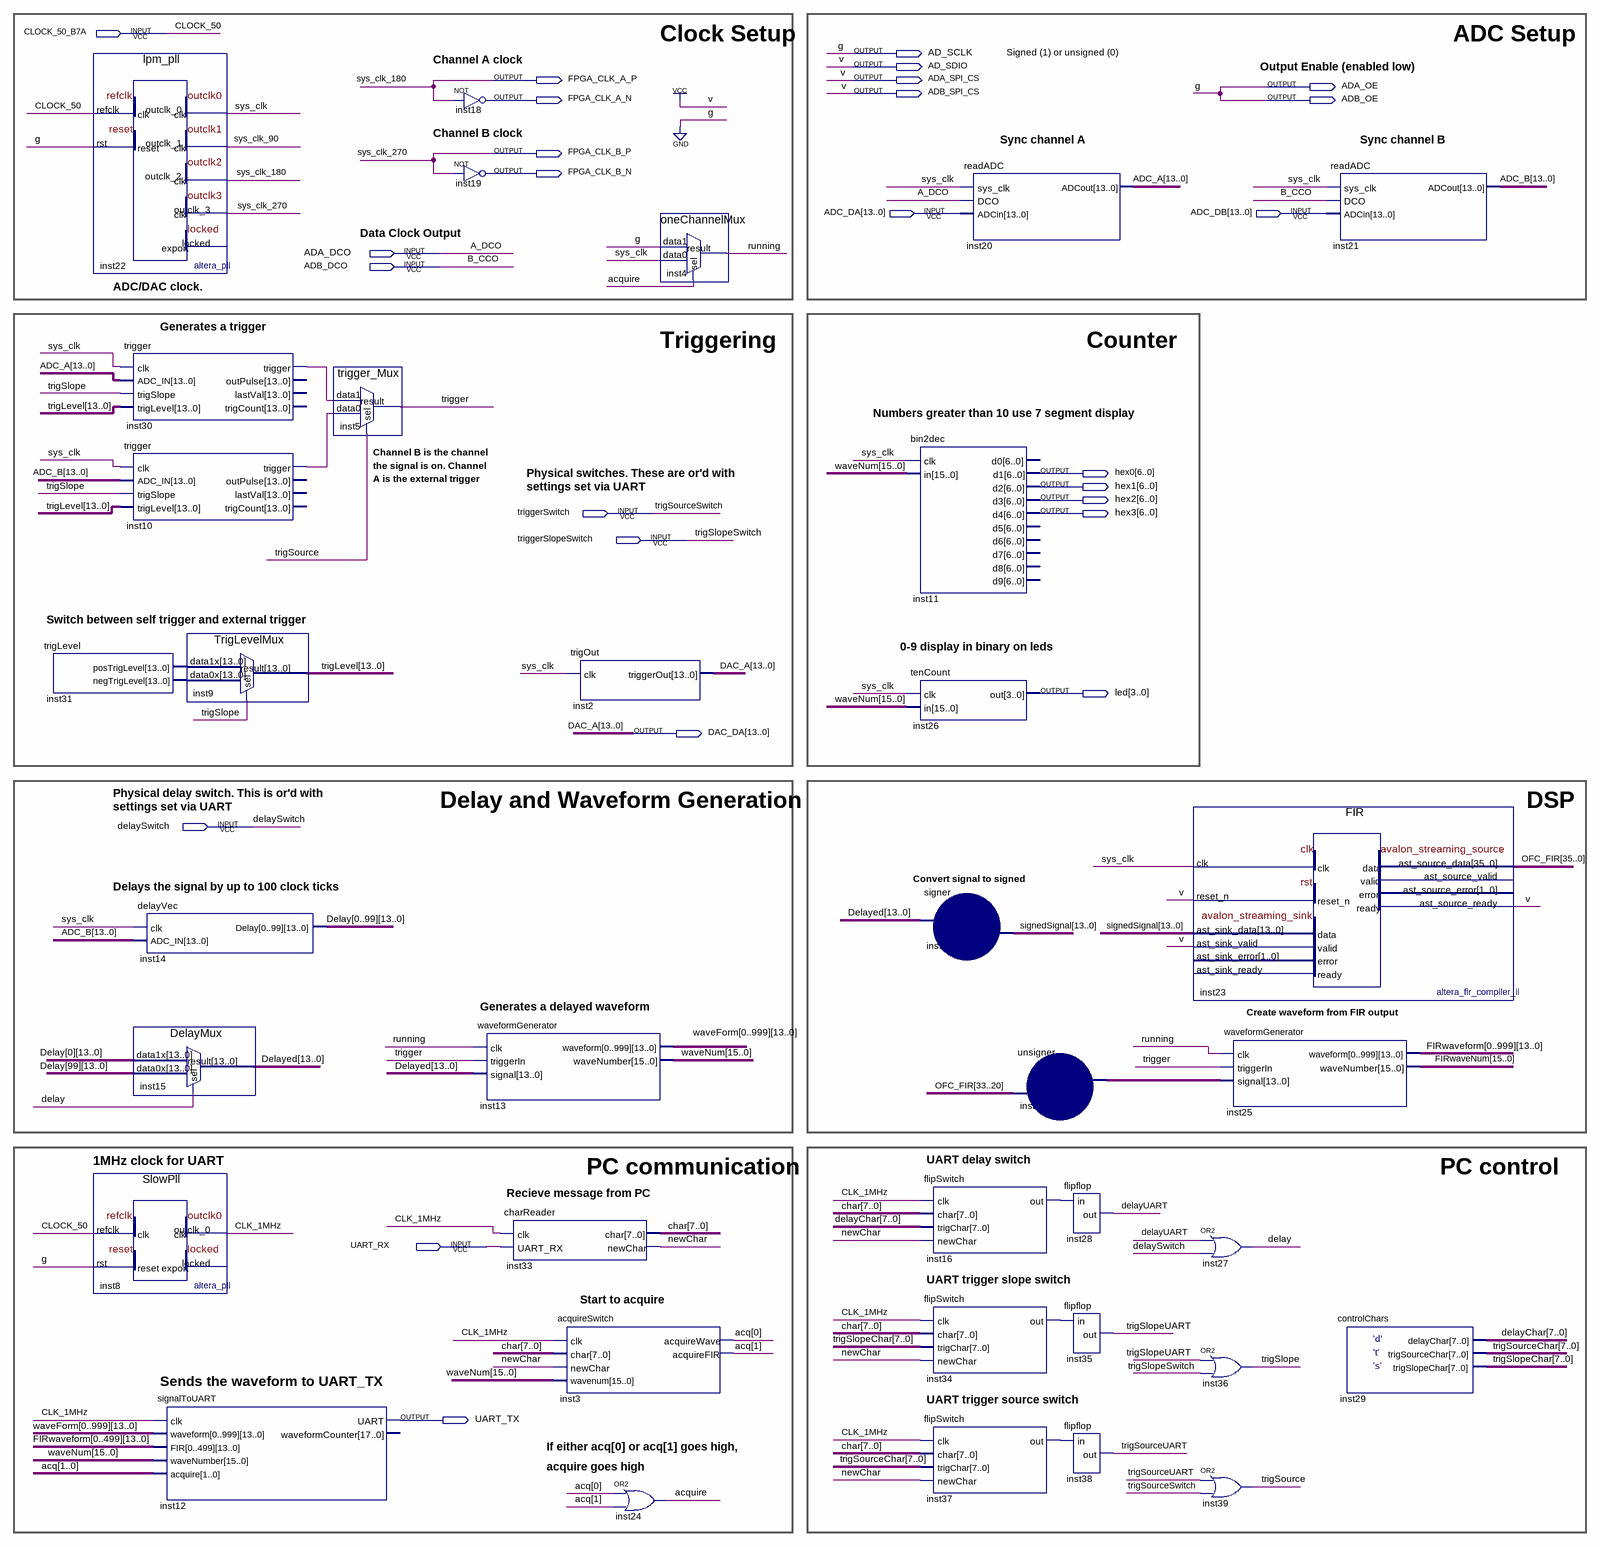
[diagram p0: schematic sheet]
// Quartus schematic ADC2UART_top.bdf as structural Verilog: 36 symbols, 26 pins
module ADC2UART_top (
  input  CLOCK_50_B7A,
  input  [13:0] ADC_DA,
  input  [13:0] ADC_DB,
  input  ADA_DCO,
  input  ADB_DCO,
  input  triggerSwitch,
  input  triggerSlopeSwitch,
  input  delaySwitch,
  input  UART_RX,
  output AD_SCLK,
  output AD_SDIO,
  output FPGA_CLK_A_P,
  output ADA_SPI_CS,
  output ADA_OE,
  output ADB_SPI_CS,
  output FPGA_CLK_A_N,
  output ADB_OE,
  output FPGA_CLK_B_P,
  output FPGA_CLK_B_N,
  output [6:0] hex0,
  output [6:0] hex1,
  output [6:0] hex2,
  output [6:0] hex3,
  output [3:0] led,
  output [13:0] DAC_DA,
  output UART_TX
);

  wire acquire, CLK_1MHz, delay, delayUART, inst10_trigger, inst16_out, inst30_trigger, inst34_out,
       inst37_out, newChar, running, sys_clk, sys_clk_90, trigger, trigSlope, trigSlopeUART, trigSource,
       trigSourceUART;
  wire [1:0] acq;
  wire [7:0] char, delayChar, trigSlopeChar, trigSourceChar;
  wire [13:0] ADC_A, ADC_B, Delay_0, Delay_1, Delay_2, Delay_3, Delay_4, Delay_5, Delay_6, Delay_7, Delay_8,
       Delay_9, Delay_10, Delay_11, Delay_12, Delay_13, Delay_14, Delay_15, Delay_16, Delay_17, Delay_18,
       Delay_19, Delay_20, Delay_21, Delay_22, Delay_23, Delay_24, Delay_25, Delay_26, Delay_27, Delay_28,
       Delay_29, Delay_30, Delay_31, Delay_32, Delay_33, Delay_34, Delay_35, Delay_36, Delay_37, Delay_38,
       Delay_39, Delay_40, Delay_41, Delay_42, Delay_43, Delay_44, Delay_45, Delay_46, Delay_47, Delay_48,
       Delay_49, Delay_50, Delay_51, Delay_52, Delay_53, Delay_54, Delay_55, Delay_56, Delay_57, Delay_58,
       Delay_59, Delay_60, Delay_61, Delay_62, Delay_63, Delay_64, Delay_65, Delay_66, Delay_67, Delay_68,
       Delay_69, Delay_70, Delay_71, Delay_72, Delay_73, Delay_74, Delay_75, Delay_76, Delay_77, Delay_78,
       Delay_79, Delay_80, Delay_81, Delay_82, Delay_83, Delay_84, Delay_85, Delay_86, Delay_87, Delay_88,
       Delay_89, Delay_90, Delay_91, Delay_92, Delay_93, Delay_94, Delay_95, Delay_96, Delay_97, Delay_98,
       Delay_99, Delayed, FIRwaveform_0, FIRwaveform_1, FIRwaveform_2, FIRwaveform_3, FIRwaveform_4,
       FIRwaveform_5, FIRwaveform_6, FIRwaveform_7, FIRwaveform_8, FIRwaveform_9, FIRwaveform_10,
       FIRwaveform_11, FIRwaveform_12, FIRwaveform_13, FIRwaveform_14, FIRwaveform_15, FIRwaveform_16,
       FIRwaveform_17, FIRwaveform_18, FIRwaveform_19, FIRwaveform_20, FIRwaveform_21, FIRwaveform_22,
       FIRwaveform_23, FIRwaveform_24, FIRwaveform_25, FIRwaveform_26, FIRwaveform_27, FIRwaveform_28,
       FIRwaveform_29, FIRwaveform_30, FIRwaveform_31, FIRwaveform_32, FIRwaveform_33, FIRwaveform_34,
       FIRwaveform_35, FIRwaveform_36, FIRwaveform_37, FIRwaveform_38, FIRwaveform_39, FIRwaveform_40,
       FIRwaveform_41, FIRwaveform_42, FIRwaveform_43, FIRwaveform_44, FIRwaveform_45, FIRwaveform_46,
       FIRwaveform_47, FIRwaveform_48, FIRwaveform_49, FIRwaveform_50, FIRwaveform_51, FIRwaveform_52,
       FIRwaveform_53, FIRwaveform_54, FIRwaveform_55, FIRwaveform_56, FIRwaveform_57, FIRwaveform_58,
       FIRwaveform_59, FIRwaveform_60, FIRwaveform_61, FIRwaveform_62, FIRwaveform_63, FIRwaveform_64,
       FIRwaveform_65, FIRwaveform_66, FIRwaveform_67, FIRwaveform_68, FIRwaveform_69, FIRwaveform_70,
       FIRwaveform_71, FIRwaveform_72, FIRwaveform_73, FIRwaveform_74, FIRwaveform_75, FIRwaveform_76,
       FIRwaveform_77, FIRwaveform_78, FIRwaveform_79, FIRwaveform_80, FIRwaveform_81, FIRwaveform_82,
       FIRwaveform_83, FIRwaveform_84, FIRwaveform_85, FIRwaveform_86, FIRwaveform_87, FIRwaveform_88,
       FIRwaveform_89, FIRwaveform_90, FIRwaveform_91, FIRwaveform_92, FIRwaveform_93, FIRwaveform_94,
       FIRwaveform_95, FIRwaveform_96, FIRwaveform_97, FIRwaveform_98, FIRwaveform_99, FIRwaveform_100,
       FIRwaveform_101, FIRwaveform_102, FIRwaveform_103, FIRwaveform_104, FIRwaveform_105, FIRwaveform_106,
       FIRwaveform_107, FIRwaveform_108, FIRwaveform_109, FIRwaveform_110, FIRwaveform_111, FIRwaveform_112,
       FIRwaveform_113, FIRwaveform_114, FIRwaveform_115, FIRwaveform_116, FIRwaveform_117, FIRwaveform_118,
       FIRwaveform_119, FIRwaveform_120, FIRwaveform_121, FIRwaveform_122, FIRwaveform_123, FIRwaveform_124,
       FIRwaveform_125, FIRwaveform_126, FIRwaveform_127, FIRwaveform_128, FIRwaveform_129, FIRwaveform_130,
       FIRwaveform_131, FIRwaveform_132, FIRwaveform_133, FIRwaveform_134, FIRwaveform_135, FIRwaveform_136,
       FIRwaveform_137, FIRwaveform_138, FIRwaveform_139, FIRwaveform_140, FIRwaveform_141, FIRwaveform_142,
       FIRwaveform_143, FIRwaveform_144, FIRwaveform_145, FIRwaveform_146, FIRwaveform_147, FIRwaveform_148,
       FIRwaveform_149, FIRwaveform_150, FIRwaveform_151, FIRwaveform_152, FIRwaveform_153, FIRwaveform_154,
       FIRwaveform_155, FIRwaveform_156, FIRwaveform_157, FIRwaveform_158, FIRwaveform_159, FIRwaveform_160,
       FIRwaveform_161, FIRwaveform_162, FIRwaveform_163, FIRwaveform_164, FIRwaveform_165, FIRwaveform_166,
       FIRwaveform_167, FIRwaveform_168, FIRwaveform_169, FIRwaveform_170, FIRwaveform_171, FIRwaveform_172,
       FIRwaveform_173, FIRwaveform_174, FIRwaveform_175, FIRwaveform_176, FIRwaveform_177, FIRwaveform_178,
       FIRwaveform_179, FIRwaveform_180, FIRwaveform_181, FIRwaveform_182, FIRwaveform_183, FIRwaveform_184,
       FIRwaveform_185, FIRwaveform_186, FIRwaveform_187, FIRwaveform_188, FIRwaveform_189, FIRwaveform_190,
       FIRwaveform_191, FIRwaveform_192, FIRwaveform_193, FIRwaveform_194, FIRwaveform_195, FIRwaveform_196,
       FIRwaveform_197, FIRwaveform_198, FIRwaveform_199, FIRwaveform_200, FIRwaveform_201, FIRwaveform_202,
       FIRwaveform_203, FIRwaveform_204, FIRwaveform_205, FIRwaveform_206, FIRwaveform_207, FIRwaveform_208,
       FIRwaveform_209, FIRwaveform_210, FIRwaveform_211, FIRwaveform_212, FIRwaveform_213, FIRwaveform_214,
       FIRwaveform_215, FIRwaveform_216, FIRwaveform_217, FIRwaveform_218, FIRwaveform_219, FIRwaveform_220,
       FIRwaveform_221, FIRwaveform_222, FIRwaveform_223, FIRwaveform_224, FIRwaveform_225, FIRwaveform_226,
       FIRwaveform_227, FIRwaveform_228, FIRwaveform_229, FIRwaveform_230, FIRwaveform_231, FIRwaveform_232,
       FIRwaveform_233, FIRwaveform_234, FIRwaveform_235, FIRwaveform_236, FIRwaveform_237, FIRwaveform_238,
       FIRwaveform_239, FIRwaveform_240, FIRwaveform_241, FIRwaveform_242, FIRwaveform_243, FIRwaveform_244,
       FIRwaveform_245, FIRwaveform_246, FIRwaveform_247, FIRwaveform_248, FIRwaveform_249, FIRwaveform_250,
       FIRwaveform_251, FIRwaveform_252, FIRwaveform_253, FIRwaveform_254, FIRwaveform_255, FIRwaveform_256,
       FIRwaveform_257, FIRwaveform_258, FIRwaveform_259, FIRwaveform_260, FIRwaveform_261, FIRwaveform_262,
       FIRwaveform_263, FIRwaveform_264, FIRwaveform_265, FIRwaveform_266, FIRwaveform_267, FIRwaveform_268,
       FIRwaveform_269, FIRwaveform_270, FIRwaveform_271, FIRwaveform_272, FIRwaveform_273, FIRwaveform_274,
       FIRwaveform_275, FIRwaveform_276, FIRwaveform_277, FIRwaveform_278, FIRwaveform_279, FIRwaveform_280,
       FIRwaveform_281, FIRwaveform_282, FIRwaveform_283, FIRwaveform_284, FIRwaveform_285, FIRwaveform_286,
       FIRwaveform_287, FIRwaveform_288, FIRwaveform_289, FIRwaveform_290, FIRwaveform_291, FIRwaveform_292,
       FIRwaveform_293, FIRwaveform_294, FIRwaveform_295, FIRwaveform_296, FIRwaveform_297, FIRwaveform_298,
       FIRwaveform_299, FIRwaveform_300, FIRwaveform_301, FIRwaveform_302, FIRwaveform_303, FIRwaveform_304,
       FIRwaveform_305, FIRwaveform_306, FIRwaveform_307, FIRwaveform_308, FIRwaveform_309, FIRwaveform_310,
       FIRwaveform_311, FIRwaveform_312, FIRwaveform_313, FIRwaveform_314, FIRwaveform_315, FIRwaveform_316,
       FIRwaveform_317, FIRwaveform_318, FIRwaveform_319, FIRwaveform_320, FIRwaveform_321, FIRwaveform_322,
       FIRwaveform_323, FIRwaveform_324, FIRwaveform_325, FIRwaveform_326, FIRwaveform_327, FIRwaveform_328,
       FIRwaveform_329, FIRwaveform_330, FIRwaveform_331, FIRwaveform_332, FIRwaveform_333, FIRwaveform_334,
       FIRwaveform_335, FIRwaveform_336, FIRwaveform_337, FIRwaveform_338, FIRwaveform_339, FIRwaveform_340,
       FIRwaveform_341, FIRwaveform_342, FIRwaveform_343, FIRwaveform_344, FIRwaveform_345, FIRwaveform_346,
       FIRwaveform_347, FIRwaveform_348, FIRwaveform_349, FIRwaveform_350, FIRwaveform_351, FIRwaveform_352,
       FIRwaveform_353, FIRwaveform_354, FIRwaveform_355, FIRwaveform_356, FIRwaveform_357, FIRwaveform_358,
       FIRwaveform_359, FIRwaveform_360, FIRwaveform_361, FIRwaveform_362, FIRwaveform_363, FIRwaveform_364,
       FIRwaveform_365, FIRwaveform_366, FIRwaveform_367, FIRwaveform_368, FIRwaveform_369, FIRwaveform_370,
       FIRwaveform_371, FIRwaveform_372, FIRwaveform_373, FIRwaveform_374, FIRwaveform_375, FIRwaveform_376,
       FIRwaveform_377, FIRwaveform_378, FIRwaveform_379, FIRwaveform_380, FIRwaveform_381, FIRwaveform_382,
       FIRwaveform_383, FIRwaveform_384, FIRwaveform_385, FIRwaveform_386, FIRwaveform_387, FIRwaveform_388,
       FIRwaveform_389, FIRwaveform_390, FIRwaveform_391, FIRwaveform_392, FIRwaveform_393, FIRwaveform_394,
       FIRwaveform_395, FIRwaveform_396, FIRwaveform_397, FIRwaveform_398, FIRwaveform_399, FIRwaveform_400,
       FIRwaveform_401, FIRwaveform_402, FIRwaveform_403, FIRwaveform_404, FIRwaveform_405, FIRwaveform_406,
       FIRwaveform_407, FIRwaveform_408, FIRwaveform_409, FIRwaveform_410, FIRwaveform_411, FIRwaveform_412,
       FIRwaveform_413, FIRwaveform_414, FIRwaveform_415, FIRwaveform_416, FIRwaveform_417, FIRwaveform_418,
       FIRwaveform_419, FIRwaveform_420, FIRwaveform_421, FIRwaveform_422, FIRwaveform_423, FIRwaveform_424,
       FIRwaveform_425, FIRwaveform_426, FIRwaveform_427, FIRwaveform_428, FIRwaveform_429, FIRwaveform_430,
       FIRwaveform_431, FIRwaveform_432, FIRwaveform_433, FIRwaveform_434, FIRwaveform_435, FIRwaveform_436,
       FIRwaveform_437, FIRwaveform_438, FIRwaveform_439, FIRwaveform_440, FIRwaveform_441, FIRwaveform_442,
       FIRwaveform_443, FIRwaveform_444, FIRwaveform_445, FIRwaveform_446, FIRwaveform_447, FIRwaveform_448,
       FIRwaveform_449, FIRwaveform_450, FIRwaveform_451, FIRwaveform_452, FIRwaveform_453, FIRwaveform_454,
       FIRwaveform_455, FIRwaveform_456, FIRwaveform_457, FIRwaveform_458, FIRwaveform_459, FIRwaveform_460,
       FIRwaveform_461, FIRwaveform_462, FIRwaveform_463, FIRwaveform_464, FIRwaveform_465, FIRwaveform_466,
       FIRwaveform_467, FIRwaveform_468, FIRwaveform_469, FIRwaveform_470, FIRwaveform_471, FIRwaveform_472,
       FIRwaveform_473, FIRwaveform_474, FIRwaveform_475, FIRwaveform_476, FIRwaveform_477, FIRwaveform_478,
       FIRwaveform_479, FIRwaveform_480, FIRwaveform_481, FIRwaveform_482, FIRwaveform_483, FIRwaveform_484,
       FIRwaveform_485, FIRwaveform_486, FIRwaveform_487, FIRwaveform_488, FIRwaveform_489, FIRwaveform_490,
       FIRwaveform_491, FIRwaveform_492, FIRwaveform_493, FIRwaveform_494, FIRwaveform_495, FIRwaveform_496,
       FIRwaveform_497, FIRwaveform_498, FIRwaveform_499, FIRwaveform_500, FIRwaveform_501, FIRwaveform_502,
       FIRwaveform_503, FIRwaveform_504, FIRwaveform_505, FIRwaveform_506, FIRwaveform_507, FIRwaveform_508,
       FIRwaveform_509, FIRwaveform_510, FIRwaveform_511, FIRwaveform_512, FIRwaveform_513, FIRwaveform_514,
       FIRwaveform_515, FIRwaveform_516, FIRwaveform_517, FIRwaveform_518, FIRwaveform_519, FIRwaveform_520,
       FIRwaveform_521, FIRwaveform_522, FIRwaveform_523, FIRwaveform_524, FIRwaveform_525, FIRwaveform_526,
       FIRwaveform_527, FIRwaveform_528, FIRwaveform_529, FIRwaveform_530, FIRwaveform_531, FIRwaveform_532,
       FIRwaveform_533, FIRwaveform_534, FIRwaveform_535, FIRwaveform_536, FIRwaveform_537, FIRwaveform_538,
       FIRwaveform_539, FIRwaveform_540, FIRwaveform_541, FIRwaveform_542, FIRwaveform_543, FIRwaveform_544,
       FIRwaveform_545, FIRwaveform_546, FIRwaveform_547, FIRwaveform_548, FIRwaveform_549, FIRwaveform_550,
       FIRwaveform_551, FIRwaveform_552, FIRwaveform_553, FIRwaveform_554, FIRwaveform_555, FIRwaveform_556,
       FIRwaveform_557, FIRwaveform_558, FIRwaveform_559, FIRwaveform_560, FIRwaveform_561, FIRwaveform_562,
       FIRwaveform_563, FIRwaveform_564, FIRwaveform_565, FIRwaveform_566, FIRwaveform_567, FIRwaveform_568,
       FIRwaveform_569, FIRwaveform_570, FIRwaveform_571, FIRwaveform_572, FIRwaveform_573, FIRwaveform_574,
       FIRwaveform_575, FIRwaveform_576, FIRwaveform_577, FIRwaveform_578, FIRwaveform_579, FIRwaveform_580,
       FIRwaveform_581, FIRwaveform_582, FIRwaveform_583, FIRwaveform_584, FIRwaveform_585, FIRwaveform_586,
       FIRwaveform_587, FIRwaveform_588, FIRwaveform_589, FIRwaveform_590, FIRwaveform_591, FIRwaveform_592,
       FIRwaveform_593, FIRwaveform_594, FIRwaveform_595, FIRwaveform_596, FIRwaveform_597, FIRwaveform_598,
       FIRwaveform_599, FIRwaveform_600, FIRwaveform_601, FIRwaveform_602, FIRwaveform_603, FIRwaveform_604,
       FIRwaveform_605, FIRwaveform_606, FIRwaveform_607, FIRwaveform_608, FIRwaveform_609, FIRwaveform_610,
       FIRwaveform_611, FIRwaveform_612, FIRwaveform_613, FIRwaveform_614, FIRwaveform_615, FIRwaveform_616,
       FIRwaveform_617, FIRwaveform_618, FIRwaveform_619, FIRwaveform_620, FIRwaveform_621, FIRwaveform_622,
       FIRwaveform_623, FIRwaveform_624, FIRwaveform_625, FIRwaveform_626, FIRwaveform_627, FIRwaveform_628,
       FIRwaveform_629, FIRwaveform_630, FIRwaveform_631, FIRwaveform_632, FIRwaveform_633, FIRwaveform_634,
       FIRwaveform_635, FIRwaveform_636, FIRwaveform_637, FIRwaveform_638, FIRwaveform_639, FIRwaveform_640,
       FIRwaveform_641, FIRwaveform_642, FIRwaveform_643, FIRwaveform_644, FIRwaveform_645, FIRwaveform_646,
       FIRwaveform_647, FIRwaveform_648, FIRwaveform_649, FIRwaveform_650, FIRwaveform_651, FIRwaveform_652,
       FIRwaveform_653, FIRwaveform_654, FIRwaveform_655, FIRwaveform_656, FIRwaveform_657, FIRwaveform_658,
       FIRwaveform_659, FIRwaveform_660, FIRwaveform_661, FIRwaveform_662, FIRwaveform_663, FIRwaveform_664,
       FIRwaveform_665, FIRwaveform_666, FIRwaveform_667, FIRwaveform_668, FIRwaveform_669, FIRwaveform_670,
       FIRwaveform_671, FIRwaveform_672, FIRwaveform_673, FIRwaveform_674, FIRwaveform_675, FIRwaveform_676,
       FIRwaveform_677, FIRwaveform_678, FIRwaveform_679, FIRwaveform_680, FIRwaveform_681, FIRwaveform_682,
       FIRwaveform_683, FIRwaveform_684, FIRwaveform_685, FIRwaveform_686, FIRwaveform_687, FIRwaveform_688,
       FIRwaveform_689, FIRwaveform_690, FIRwaveform_691, FIRwaveform_692, FIRwaveform_693, FIRwaveform_694,
       FIRwaveform_695, FIRwaveform_696, FIRwaveform_697, FIRwaveform_698, FIRwaveform_699, FIRwaveform_700,
       FIRwaveform_701, FIRwaveform_702, FIRwaveform_703, FIRwaveform_704, FIRwaveform_705, FIRwaveform_706,
       FIRwaveform_707, FIRwaveform_708, FIRwaveform_709, FIRwaveform_710, FIRwaveform_711, FIRwaveform_712,
       FIRwaveform_713, FIRwaveform_714, FIRwaveform_715, FIRwaveform_716, FIRwaveform_717, FIRwaveform_718,
       FIRwaveform_719, FIRwaveform_720, FIRwaveform_721, FIRwaveform_722, FIRwaveform_723, FIRwaveform_724,
       FIRwaveform_725, FIRwaveform_726, FIRwaveform_727, FIRwaveform_728, FIRwaveform_729, FIRwaveform_730,
       FIRwaveform_731, FIRwaveform_732, FIRwaveform_733, FIRwaveform_734, FIRwaveform_735, FIRwaveform_736,
       FIRwaveform_737, FIRwaveform_738, FIRwaveform_739, FIRwaveform_740, FIRwaveform_741, FIRwaveform_742,
       FIRwaveform_743, FIRwaveform_744, FIRwaveform_745, FIRwaveform_746, FIRwaveform_747, FIRwaveform_748,
       FIRwaveform_749, FIRwaveform_750, FIRwaveform_751, FIRwaveform_752, FIRwaveform_753, FIRwaveform_754,
       FIRwaveform_755, FIRwaveform_756, FIRwaveform_757, FIRwaveform_758, FIRwaveform_759, FIRwaveform_760,
       FIRwaveform_761, FIRwaveform_762, FIRwaveform_763, FIRwaveform_764, FIRwaveform_765, FIRwaveform_766,
       FIRwaveform_767, FIRwaveform_768, FIRwaveform_769, FIRwaveform_770, FIRwaveform_771, FIRwaveform_772,
       FIRwaveform_773, FIRwaveform_774, FIRwaveform_775, FIRwaveform_776, FIRwaveform_777, FIRwaveform_778,
       FIRwaveform_779, FIRwaveform_780, FIRwaveform_781, FIRwaveform_782, FIRwaveform_783, FIRwaveform_784,
       FIRwaveform_785, FIRwaveform_786, FIRwaveform_787, FIRwaveform_788, FIRwaveform_789, FIRwaveform_790,
       FIRwaveform_791, FIRwaveform_792, FIRwaveform_793, FIRwaveform_794, FIRwaveform_795, FIRwaveform_796,
       FIRwaveform_797, FIRwaveform_798, FIRwaveform_799, FIRwaveform_800, FIRwaveform_801, FIRwaveform_802,
       FIRwaveform_803, FIRwaveform_804, FIRwaveform_805, FIRwaveform_806, FIRwaveform_807, FIRwaveform_808,
       FIRwaveform_809, FIRwaveform_810, FIRwaveform_811, FIRwaveform_812, FIRwaveform_813, FIRwaveform_814,
       FIRwaveform_815, FIRwaveform_816, FIRwaveform_817, FIRwaveform_818, FIRwaveform_819, FIRwaveform_820,
       FIRwaveform_821, FIRwaveform_822, FIRwaveform_823, FIRwaveform_824, FIRwaveform_825, FIRwaveform_826,
       FIRwaveform_827, FIRwaveform_828, FIRwaveform_829, FIRwaveform_830, FIRwaveform_831, FIRwaveform_832,
       FIRwaveform_833, FIRwaveform_834, FIRwaveform_835, FIRwaveform_836, FIRwaveform_837, FIRwaveform_838,
       FIRwaveform_839, FIRwaveform_840, FIRwaveform_841, FIRwaveform_842, FIRwaveform_843, FIRwaveform_844,
       FIRwaveform_845, FIRwaveform_846, FIRwaveform_847, FIRwaveform_848, FIRwaveform_849, FIRwaveform_850,
       FIRwaveform_851, FIRwaveform_852, FIRwaveform_853, FIRwaveform_854, FIRwaveform_855, FIRwaveform_856,
       FIRwaveform_857, FIRwaveform_858, FIRwaveform_859, FIRwaveform_860, FIRwaveform_861, FIRwaveform_862,
       FIRwaveform_863, FIRwaveform_864, FIRwaveform_865, FIRwaveform_866, FIRwaveform_867, FIRwaveform_868,
       FIRwaveform_869, FIRwaveform_870, FIRwaveform_871, FIRwaveform_872, FIRwaveform_873, FIRwaveform_874,
       FIRwaveform_875, FIRwaveform_876, FIRwaveform_877, FIRwaveform_878, FIRwaveform_879, FIRwaveform_880,
       FIRwaveform_881, FIRwaveform_882, FIRwaveform_883, FIRwaveform_884, FIRwaveform_885, FIRwaveform_886,
       FIRwaveform_887, FIRwaveform_888, FIRwaveform_889, FIRwaveform_890, FIRwaveform_891, FIRwaveform_892,
       FIRwaveform_893, FIRwaveform_894, FIRwaveform_895, FIRwaveform_896, FIRwaveform_897, FIRwaveform_898,
       FIRwaveform_899, FIRwaveform_900, FIRwaveform_901, FIRwaveform_902, FIRwaveform_903, FIRwaveform_904,
       FIRwaveform_905, FIRwaveform_906, FIRwaveform_907, FIRwaveform_908, FIRwaveform_909, FIRwaveform_910,
       FIRwaveform_911, FIRwaveform_912, FIRwaveform_913, FIRwaveform_914, FIRwaveform_915, FIRwaveform_916,
       FIRwaveform_917, FIRwaveform_918, FIRwaveform_919, FIRwaveform_920, FIRwaveform_921, FIRwaveform_922,
       FIRwaveform_923, FIRwaveform_924, FIRwaveform_925, FIRwaveform_926, FIRwaveform_927, FIRwaveform_928,
       FIRwaveform_929, FIRwaveform_930, FIRwaveform_931, FIRwaveform_932, FIRwaveform_933, FIRwaveform_934,
       FIRwaveform_935, FIRwaveform_936, FIRwaveform_937, FIRwaveform_938, FIRwaveform_939, FIRwaveform_940,
       FIRwaveform_941, FIRwaveform_942, FIRwaveform_943, FIRwaveform_944, FIRwaveform_945, FIRwaveform_946,
       FIRwaveform_947, FIRwaveform_948, FIRwaveform_949, FIRwaveform_950, FIRwaveform_951, FIRwaveform_952,
       FIRwaveform_953, FIRwaveform_954, FIRwaveform_955, FIRwaveform_956, FIRwaveform_957, FIRwaveform_958,
       FIRwaveform_959, FIRwaveform_960, FIRwaveform_961, FIRwaveform_962, FIRwaveform_963, FIRwaveform_964,
       FIRwaveform_965, FIRwaveform_966, FIRwaveform_967, FIRwaveform_968, FIRwaveform_969, FIRwaveform_970,
       FIRwaveform_971, FIRwaveform_972, FIRwaveform_973, FIRwaveform_974, FIRwaveform_975, FIRwaveform_976,
       FIRwaveform_977, FIRwaveform_978, FIRwaveform_979, FIRwaveform_980, FIRwaveform_981, FIRwaveform_982,
       FIRwaveform_983, FIRwaveform_984, FIRwaveform_985, FIRwaveform_986, FIRwaveform_987, FIRwaveform_988,
       FIRwaveform_989, FIRwaveform_990, FIRwaveform_991, FIRwaveform_992, FIRwaveform_993, FIRwaveform_994,
       FIRwaveform_995, FIRwaveform_996, FIRwaveform_997, FIRwaveform_998, FIRwaveform_999,
       inst31_negtriglevel, inst31_postriglevel, inst32_unsign, signedSignal, trigLevel, waveForm_0,
       waveForm_1, waveForm_2, waveForm_3, waveForm_4, waveForm_5, waveForm_6, waveForm_7, waveForm_8,
       waveForm_9, waveForm_10, waveForm_11, waveForm_12, waveForm_13, waveForm_14, waveForm_15, waveForm_16,
       waveForm_17, waveForm_18, waveForm_19, waveForm_20, waveForm_21, waveForm_22, waveForm_23,
       waveForm_24, waveForm_25, waveForm_26, waveForm_27, waveForm_28, waveForm_29, waveForm_30,
       waveForm_31, waveForm_32, waveForm_33, waveForm_34, waveForm_35, waveForm_36, waveForm_37,
       waveForm_38, waveForm_39, waveForm_40, waveForm_41, waveForm_42, waveForm_43, waveForm_44,
       waveForm_45, waveForm_46, waveForm_47, waveForm_48, waveForm_49, waveForm_50, waveForm_51,
       waveForm_52, waveForm_53, waveForm_54, waveForm_55, waveForm_56, waveForm_57, waveForm_58,
       waveForm_59, waveForm_60, waveForm_61, waveForm_62, waveForm_63, waveForm_64, waveForm_65,
       waveForm_66, waveForm_67, waveForm_68, waveForm_69, waveForm_70, waveForm_71, waveForm_72,
       waveForm_73, waveForm_74, waveForm_75, waveForm_76, waveForm_77, waveForm_78, waveForm_79,
       waveForm_80, waveForm_81, waveForm_82, waveForm_83, waveForm_84, waveForm_85, waveForm_86,
       waveForm_87, waveForm_88, waveForm_89, waveForm_90, waveForm_91, waveForm_92, waveForm_93,
       waveForm_94, waveForm_95, waveForm_96, waveForm_97, waveForm_98, waveForm_99, waveForm_100,
       waveForm_101, waveForm_102, waveForm_103, waveForm_104, waveForm_105, waveForm_106, waveForm_107,
       waveForm_108, waveForm_109, waveForm_110, waveForm_111, waveForm_112, waveForm_113, waveForm_114,
       waveForm_115, waveForm_116, waveForm_117, waveForm_118, waveForm_119, waveForm_120, waveForm_121,
       waveForm_122, waveForm_123, waveForm_124, waveForm_125, waveForm_126, waveForm_127, waveForm_128,
       waveForm_129, waveForm_130, waveForm_131, waveForm_132, waveForm_133, waveForm_134, waveForm_135,
       waveForm_136, waveForm_137, waveForm_138, waveForm_139, waveForm_140, waveForm_141, waveForm_142,
       waveForm_143, waveForm_144, waveForm_145, waveForm_146, waveForm_147, waveForm_148, waveForm_149,
       waveForm_150, waveForm_151, waveForm_152, waveForm_153, waveForm_154, waveForm_155, waveForm_156,
       waveForm_157, waveForm_158, waveForm_159, waveForm_160, waveForm_161, waveForm_162, waveForm_163,
       waveForm_164, waveForm_165, waveForm_166, waveForm_167, waveForm_168, waveForm_169, waveForm_170,
       waveForm_171, waveForm_172, waveForm_173, waveForm_174, waveForm_175, waveForm_176, waveForm_177,
       waveForm_178, waveForm_179, waveForm_180, waveForm_181, waveForm_182, waveForm_183, waveForm_184,
       waveForm_185, waveForm_186, waveForm_187, waveForm_188, waveForm_189, waveForm_190, waveForm_191,
       waveForm_192, waveForm_193, waveForm_194, waveForm_195, waveForm_196, waveForm_197, waveForm_198,
       waveForm_199, waveForm_200, waveForm_201, waveForm_202, waveForm_203, waveForm_204, waveForm_205,
       waveForm_206, waveForm_207, waveForm_208, waveForm_209, waveForm_210, waveForm_211, waveForm_212,
       waveForm_213, waveForm_214, waveForm_215, waveForm_216, waveForm_217, waveForm_218, waveForm_219,
       waveForm_220, waveForm_221, waveForm_222, waveForm_223, waveForm_224, waveForm_225, waveForm_226,
       waveForm_227, waveForm_228, waveForm_229, waveForm_230, waveForm_231, waveForm_232, waveForm_233,
       waveForm_234, waveForm_235, waveForm_236, waveForm_237, waveForm_238, waveForm_239, waveForm_240,
       waveForm_241, waveForm_242, waveForm_243, waveForm_244, waveForm_245, waveForm_246, waveForm_247,
       waveForm_248, waveForm_249, waveForm_250, waveForm_251, waveForm_252, waveForm_253, waveForm_254,
       waveForm_255, waveForm_256, waveForm_257, waveForm_258, waveForm_259, waveForm_260, waveForm_261,
       waveForm_262, waveForm_263, waveForm_264, waveForm_265, waveForm_266, waveForm_267, waveForm_268,
       waveForm_269, waveForm_270, waveForm_271, waveForm_272, waveForm_273, waveForm_274, waveForm_275,
       waveForm_276, waveForm_277, waveForm_278, waveForm_279, waveForm_280, waveForm_281, waveForm_282,
       waveForm_283, waveForm_284, waveForm_285, waveForm_286, waveForm_287, waveForm_288, waveForm_289,
       waveForm_290, waveForm_291, waveForm_292, waveForm_293, waveForm_294, waveForm_295, waveForm_296,
       waveForm_297, waveForm_298, waveForm_299, waveForm_300, waveForm_301, waveForm_302, waveForm_303,
       waveForm_304, waveForm_305, waveForm_306, waveForm_307, waveForm_308, waveForm_309, waveForm_310,
       waveForm_311, waveForm_312, waveForm_313, waveForm_314, waveForm_315, waveForm_316, waveForm_317,
       waveForm_318, waveForm_319, waveForm_320, waveForm_321, waveForm_322, waveForm_323, waveForm_324,
       waveForm_325, waveForm_326, waveForm_327, waveForm_328, waveForm_329, waveForm_330, waveForm_331,
       waveForm_332, waveForm_333, waveForm_334, waveForm_335, waveForm_336, waveForm_337, waveForm_338,
       waveForm_339, waveForm_340, waveForm_341, waveForm_342, waveForm_343, waveForm_344, waveForm_345,
       waveForm_346, waveForm_347, waveForm_348, waveForm_349, waveForm_350, waveForm_351, waveForm_352,
       waveForm_353, waveForm_354, waveForm_355, waveForm_356, waveForm_357, waveForm_358, waveForm_359,
       waveForm_360, waveForm_361, waveForm_362, waveForm_363, waveForm_364, waveForm_365, waveForm_366,
       waveForm_367, waveForm_368, waveForm_369, waveForm_370, waveForm_371, waveForm_372, waveForm_373,
       waveForm_374, waveForm_375, waveForm_376, waveForm_377, waveForm_378, waveForm_379, waveForm_380,
       waveForm_381, waveForm_382, waveForm_383, waveForm_384, waveForm_385, waveForm_386, waveForm_387,
       waveForm_388, waveForm_389, waveForm_390, waveForm_391, waveForm_392, waveForm_393, waveForm_394,
       waveForm_395, waveForm_396, waveForm_397, waveForm_398, waveForm_399, waveForm_400, waveForm_401,
       waveForm_402, waveForm_403, waveForm_404, waveForm_405, waveForm_406, waveForm_407, waveForm_408,
       waveForm_409, waveForm_410, waveForm_411, waveForm_412, waveForm_413, waveForm_414, waveForm_415,
       waveForm_416, waveForm_417, waveForm_418, waveForm_419, waveForm_420, waveForm_421, waveForm_422,
       waveForm_423, waveForm_424, waveForm_425, waveForm_426, waveForm_427, waveForm_428, waveForm_429,
       waveForm_430, waveForm_431, waveForm_432, waveForm_433, waveForm_434, waveForm_435, waveForm_436,
       waveForm_437, waveForm_438, waveForm_439, waveForm_440, waveForm_441, waveForm_442, waveForm_443,
       waveForm_444, waveForm_445, waveForm_446, waveForm_447, waveForm_448, waveForm_449, waveForm_450,
       waveForm_451, waveForm_452, waveForm_453, waveForm_454, waveForm_455, waveForm_456, waveForm_457,
       waveForm_458, waveForm_459, waveForm_460, waveForm_461, waveForm_462, waveForm_463, waveForm_464,
       waveForm_465, waveForm_466, waveForm_467, waveForm_468, waveForm_469, waveForm_470, waveForm_471,
       waveForm_472, waveForm_473, waveForm_474, waveForm_475, waveForm_476, waveForm_477, waveForm_478,
       waveForm_479, waveForm_480, waveForm_481, waveForm_482, waveForm_483, waveForm_484, waveForm_485,
       waveForm_486, waveForm_487, waveForm_488, waveForm_489, waveForm_490, waveForm_491, waveForm_492,
       waveForm_493, waveForm_494, waveForm_495, waveForm_496, waveForm_497, waveForm_498, waveForm_499,
       waveForm_500, waveForm_501, waveForm_502, waveForm_503, waveForm_504, waveForm_505, waveForm_506,
       waveForm_507, waveForm_508, waveForm_509, waveForm_510, waveForm_511, waveForm_512, waveForm_513,
       waveForm_514, waveForm_515, waveForm_516, waveForm_517, waveForm_518, waveForm_519, waveForm_520,
       waveForm_521, waveForm_522, waveForm_523, waveForm_524, waveForm_525, waveForm_526, waveForm_527,
       waveForm_528, waveForm_529, waveForm_530, waveForm_531, waveForm_532, waveForm_533, waveForm_534,
       waveForm_535, waveForm_536, waveForm_537, waveForm_538, waveForm_539, waveForm_540, waveForm_541,
       waveForm_542, waveForm_543, waveForm_544, waveForm_545, waveForm_546, waveForm_547, waveForm_548,
       waveForm_549, waveForm_550, waveForm_551, waveForm_552, waveForm_553, waveForm_554, waveForm_555,
       waveForm_556, waveForm_557, waveForm_558, waveForm_559, waveForm_560, waveForm_561, waveForm_562,
       waveForm_563, waveForm_564, waveForm_565, waveForm_566, waveForm_567, waveForm_568, waveForm_569,
       waveForm_570, waveForm_571, waveForm_572, waveForm_573, waveForm_574, waveForm_575, waveForm_576,
       waveForm_577, waveForm_578, waveForm_579, waveForm_580, waveForm_581, waveForm_582, waveForm_583,
       waveForm_584, waveForm_585, waveForm_586, waveForm_587, waveForm_588, waveForm_589, waveForm_590,
       waveForm_591, waveForm_592, waveForm_593, waveForm_594, waveForm_595, waveForm_596, waveForm_597,
       waveForm_598, waveForm_599, waveForm_600, waveForm_601, waveForm_602, waveForm_603, waveForm_604,
       waveForm_605, waveForm_606, waveForm_607, waveForm_608, waveForm_609, waveForm_610, waveForm_611,
       waveForm_612, waveForm_613, waveForm_614, waveForm_615, waveForm_616, waveForm_617, waveForm_618,
       waveForm_619, waveForm_620, waveForm_621, waveForm_622, waveForm_623, waveForm_624, waveForm_625,
       waveForm_626, waveForm_627, waveForm_628, waveForm_629, waveForm_630, waveForm_631, waveForm_632,
       waveForm_633, waveForm_634, waveForm_635, waveForm_636, waveForm_637, waveForm_638, waveForm_639,
       waveForm_640, waveForm_641, waveForm_642, waveForm_643, waveForm_644, waveForm_645, waveForm_646,
       waveForm_647, waveForm_648, waveForm_649, waveForm_650, waveForm_651, waveForm_652, waveForm_653,
       waveForm_654, waveForm_655, waveForm_656, waveForm_657, waveForm_658, waveForm_659, waveForm_660,
       waveForm_661, waveForm_662, waveForm_663, waveForm_664, waveForm_665, waveForm_666, waveForm_667,
       waveForm_668, waveForm_669, waveForm_670, waveForm_671, waveForm_672, waveForm_673, waveForm_674,
       waveForm_675, waveForm_676, waveForm_677, waveForm_678, waveForm_679, waveForm_680, waveForm_681,
       waveForm_682, waveForm_683, waveForm_684, waveForm_685, waveForm_686, waveForm_687, waveForm_688,
       waveForm_689, waveForm_690, waveForm_691, waveForm_692, waveForm_693, waveForm_694, waveForm_695,
       waveForm_696, waveForm_697, waveForm_698, waveForm_699, waveForm_700, waveForm_701, waveForm_702,
       waveForm_703, waveForm_704, waveForm_705, waveForm_706, waveForm_707, waveForm_708, waveForm_709,
       waveForm_710, waveForm_711, waveForm_712, waveForm_713, waveForm_714, waveForm_715, waveForm_716,
       waveForm_717, waveForm_718, waveForm_719, waveForm_720, waveForm_721, waveForm_722, waveForm_723,
       waveForm_724, waveForm_725, waveForm_726, waveForm_727, waveForm_728, waveForm_729, waveForm_730,
       waveForm_731, waveForm_732, waveForm_733, waveForm_734, waveForm_735, waveForm_736, waveForm_737,
       waveForm_738, waveForm_739, waveForm_740, waveForm_741, waveForm_742, waveForm_743, waveForm_744,
       waveForm_745, waveForm_746, waveForm_747, waveForm_748, waveForm_749, waveForm_750, waveForm_751,
       waveForm_752, waveForm_753, waveForm_754, waveForm_755, waveForm_756, waveForm_757, waveForm_758,
       waveForm_759, waveForm_760, waveForm_761, waveForm_762, waveForm_763, waveForm_764, waveForm_765,
       waveForm_766, waveForm_767, waveForm_768, waveForm_769, waveForm_770, waveForm_771, waveForm_772,
       waveForm_773, waveForm_774, waveForm_775, waveForm_776, waveForm_777, waveForm_778, waveForm_779,
       waveForm_780, waveForm_781, waveForm_782, waveForm_783, waveForm_784, waveForm_785, waveForm_786,
       waveForm_787, waveForm_788, waveForm_789, waveForm_790, waveForm_791, waveForm_792, waveForm_793,
       waveForm_794, waveForm_795, waveForm_796, waveForm_797, waveForm_798, waveForm_799, waveForm_800,
       waveForm_801, waveForm_802, waveForm_803, waveForm_804, waveForm_805, waveForm_806, waveForm_807,
       waveForm_808, waveForm_809, waveForm_810, waveForm_811, waveForm_812, waveForm_813, waveForm_814,
       waveForm_815, waveForm_816, waveForm_817, waveForm_818, waveForm_819, waveForm_820, waveForm_821,
       waveForm_822, waveForm_823, waveForm_824, waveForm_825, waveForm_826, waveForm_827, waveForm_828,
       waveForm_829, waveForm_830, waveForm_831, waveForm_832, waveForm_833, waveForm_834, waveForm_835,
       waveForm_836, waveForm_837, waveForm_838, waveForm_839, waveForm_840, waveForm_841, waveForm_842,
       waveForm_843, waveForm_844, waveForm_845, waveForm_846, waveForm_847, waveForm_848, waveForm_849,
       waveForm_850, waveForm_851, waveForm_852, waveForm_853, waveForm_854, waveForm_855, waveForm_856,
       waveForm_857, waveForm_858, waveForm_859, waveForm_860, waveForm_861, waveForm_862, waveForm_863,
       waveForm_864, waveForm_865, waveForm_866, waveForm_867, waveForm_868, waveForm_869, waveForm_870,
       waveForm_871, waveForm_872, waveForm_873, waveForm_874, waveForm_875, waveForm_876, waveForm_877,
       waveForm_878, waveForm_879, waveForm_880, waveForm_881, waveForm_882, waveForm_883, waveForm_884,
       waveForm_885, waveForm_886, waveForm_887, waveForm_888, waveForm_889, waveForm_890, waveForm_891,
       waveForm_892, waveForm_893, waveForm_894, waveForm_895, waveForm_896, waveForm_897, waveForm_898,
       waveForm_899, waveForm_900, waveForm_901, waveForm_902, waveForm_903, waveForm_904, waveForm_905,
       waveForm_906, waveForm_907, waveForm_908, waveForm_909, waveForm_910, waveForm_911, waveForm_912,
       waveForm_913, waveForm_914, waveForm_915, waveForm_916, waveForm_917, waveForm_918, waveForm_919,
       waveForm_920, waveForm_921, waveForm_922, waveForm_923, waveForm_924, waveForm_925, waveForm_926,
       waveForm_927, waveForm_928, waveForm_929, waveForm_930, waveForm_931, waveForm_932, waveForm_933,
       waveForm_934, waveForm_935, waveForm_936, waveForm_937, waveForm_938, waveForm_939, waveForm_940,
       waveForm_941, waveForm_942, waveForm_943, waveForm_944, waveForm_945, waveForm_946, waveForm_947,
       waveForm_948, waveForm_949, waveForm_950, waveForm_951, waveForm_952, waveForm_953, waveForm_954,
       waveForm_955, waveForm_956, waveForm_957, waveForm_958, waveForm_959, waveForm_960, waveForm_961,
       waveForm_962, waveForm_963, waveForm_964, waveForm_965, waveForm_966, waveForm_967, waveForm_968,
       waveForm_969, waveForm_970, waveForm_971, waveForm_972, waveForm_973, waveForm_974, waveForm_975,
       waveForm_976, waveForm_977, waveForm_978, waveForm_979, waveForm_980, waveForm_981, waveForm_982,
       waveForm_983, waveForm_984, waveForm_985, waveForm_986, waveForm_987, waveForm_988, waveForm_989,
       waveForm_990, waveForm_991, waveForm_992, waveForm_993, waveForm_994, waveForm_995, waveForm_996,
       waveForm_997, waveForm_998, waveForm_999;
  wire [15:0] FIRwaveNum, waveNum;
  wire [35:0] OFC_FIR;

  trigLevel inst31 (.posTrigLevel(inst31_postriglevel), .negTrigLevel(inst31_negtriglevel));
  lpm_pll inst22 (
    .refclk(CLOCK_50_B7A), .rst(1'b0), .outclk_0(sys_clk), .outclk_1(sys_clk_90), .outclk_2(FPGA_CLK_A_P),
    .outclk_3(FPGA_CLK_B_P));  // open: locked
  trigger inst30 (
    .clk(sys_clk), .ADC_IN(ADC_A), .trigSlope(trigSlope), .trigLevel(trigLevel), .trigger(inst30_trigger));  // open: outPulse, lastVal, trigCount
  trigger inst10 (
    .clk(sys_clk), .ADC_IN(ADC_B), .trigSlope(trigSlope), .trigLevel(trigLevel), .trigger(inst10_trigger));  // open: outPulse, lastVal, trigCount
  SlowPll inst8 (.refclk(CLOCK_50_B7A), .rst(1'b0), .outclk_0(CLK_1MHz));  // open: locked
  delayVec inst14 (
    .clk(sys_clk), .ADC_IN(ADC_B),
    .Delay({Delay_0, Delay_1, Delay_2, Delay_3, Delay_4, Delay_5, Delay_6, Delay_7, Delay_8, Delay_9, Delay_10, Delay_11, Delay_12, Delay_13, Delay_14, Delay_15, Delay_16, Delay_17, Delay_18, Delay_19, Delay_20, Delay_21, Delay_22, Delay_23, Delay_24, Delay_25, Delay_26, Delay_27, Delay_28, Delay_29, Delay_30, Delay_31, Delay_32, Delay_33, Delay_34, Delay_35, Delay_36, Delay_37, Delay_38, Delay_39, Delay_40, Delay_41, Delay_42, Delay_43, Delay_44, Delay_45, Delay_46, Delay_47, Delay_48, Delay_49, Delay_50, Delay_51, Delay_52, Delay_53, Delay_54, Delay_55, Delay_56, Delay_57, Delay_58, Delay_59, Delay_60, Delay_61, Delay_62, Delay_63, Delay_64, Delay_65, Delay_66, Delay_67, Delay_68, Delay_69, Delay_70, Delay_71, Delay_72, Delay_73, Delay_74, Delay_75, Delay_76, Delay_77, Delay_78, Delay_79, Delay_80, Delay_81, Delay_82, Delay_83, Delay_84, Delay_85, Delay_86, Delay_87, Delay_88, Delay_89, Delay_90, Delay_91, Delay_92, Delay_93, Delay_94, Delay_95, Delay_96, Delay_97, Delay_98, Delay_99}));
  DelayMux inst15 (.data1x(Delay_0), .data0x(Delay_99), .sel(delay), .result(Delayed));
